# EAGLE design main (EAGLE 7.0.0)
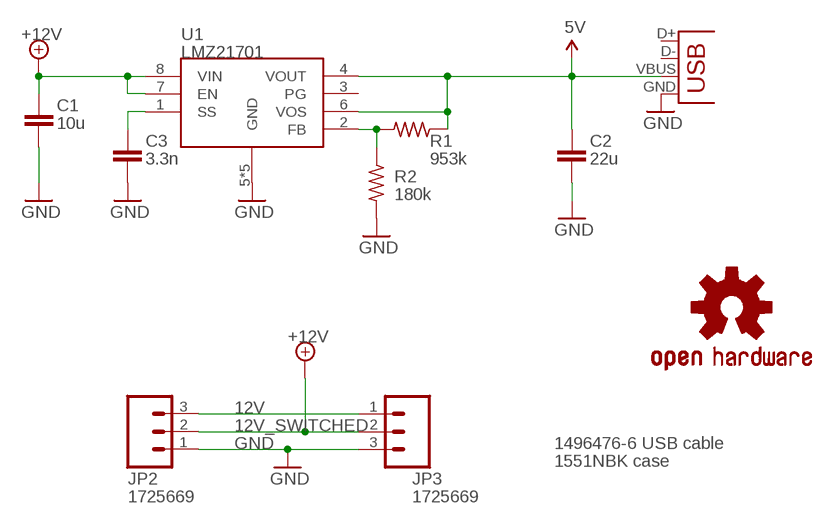
[diagram p0: schematic, sheet 1]

## Parts
C1  10u  C-EUC1206  [C1206]
C2  22u  C-EUC1206  [C1206]
C3  3.3n  C-EUC0603  [C0603]
JP1  62900416021  USB_  [USB-A-S-SILK-FEMALE]
JP2  1725669  M03PTH  [1X03]
JP3  1725669  M03PTH  [1X03]
LOGO1  OSHW-LOGOL  [OSHW-LOGO-L]
R1  953k  R-US_R0603  [R0603]
R2  180k  R-US_R0603  [R0603]
U1  LMZ21701  [LMZ21701]

## Nets
5V: C2.1 JP1.VBUS R1.1 U1.4(VOUT) U1.6(VOS)
12V: JP2.3 JP3.1
12V_SWITCHED: C1.1 JP2.2 JP3.2 U1.7(EN) U1.8(VIN) ; supply symbol labelled +12V
GND: C1.2 C2.2 C3.2 JP1.GND JP2.1 JP3.3 R2.2 U1.5(GND) U1.G1(GND) U1.G1V(GND) U1.G2(GND) U1.G2V(GND)
N$1: C3.1 U1.1(SS)
N$2: R1.2 R2.1 U1.2(FB)
Unconnected: JP1.D+ JP1.D- U1.3(PG)

## Notes on the sheet
- 1496476-6 USB cable
- 1551NBK case

## Library data of the parts
C1-C3 = rcl:C-EU: CAPACITOR, European symbol
JP1 = SparkFun-Connectors:USB: USB Connectors USB-B-PTH is fully proven SKU : PRT-00139/CONN-08278 USB-miniB is fully proven SKU : PRT-00587 USB-A-PCB is untested. USB-A-H is throughly reviewed, but untested. Spark Fun Electronics SKU : PRT-00437 USB-B-SMT is throughly reviewed, but untested. Needs silkscreen touching up. USB-A-S has not been used/tested USB-MB-H has not been used/tested USB-MICROB has been used. CONN-09505
JP2 JP3 = SparkFun-Connectors:M03: Header 3 Standard 3-pin 0.1" header. Use with straight break away headers (SKU : PRT-00116), right angle break away headers (PRT-00553), swiss pins (PRT-00743), machine pins (PRT-00117), and female headers (PRT-00115). Molex polarized connector foot print use with SKU : PRT-08232 with associated crimp pins and housings.
LOGO1 = SparkFun-Aesthetics:OSHW-LOGO: Open Source Hardware Logo This logo indicates the piece of hardware it is found on incorporates a OSHW license and/or adheres to the definition of open source hardware found here: http://freedomdefined.org/OSHW
R1 R2 = rcl:R-US_: RESISTOR, American symbol
U1 = torpedo:LMZ21701

## Board
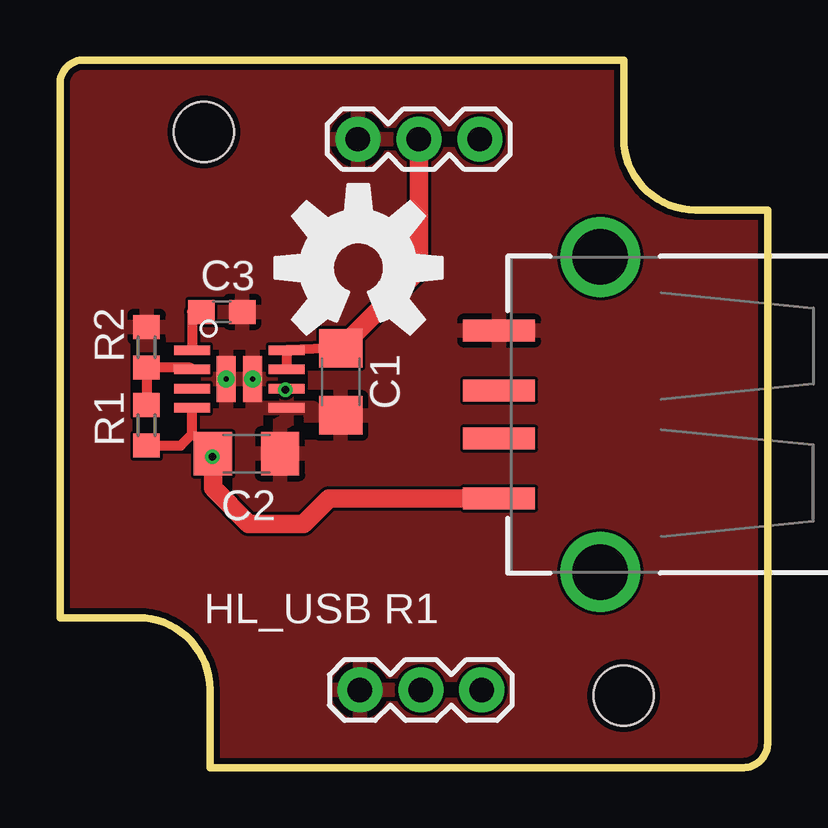
[diagram p1: board, top side]
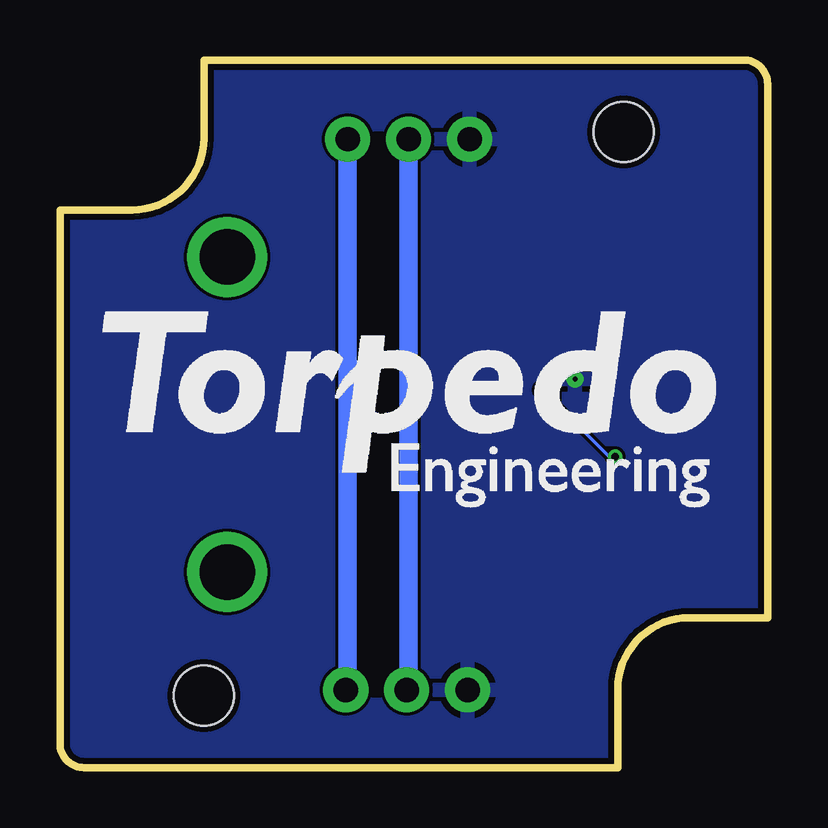
[diagram p2: board, bottom side, seen from below]

Size 29.5 x 29.5 mm. Coordinates in mm from the lower left corner, seen from the top.
Outline: 0,28.5 0,6.25 3.25,6.25 arc-90 6.25,3.25 6.25,0 28.5,0 arc90 29.5,1 29.5,23.25 26.5,23.25 arc-90 23.5,26.25 23.5,29.5 1,29.5 arc90 0,28.5
Copper layers (1*16): Top 0.035mm / dielectric 1.5mm / Bottom 0.035mm
Design rules "dirt_cheap_dirty_boards.v1": minimum track width 5mil, minimum drill 12mil, track to track 5mil, track to pad 5mil, pad to pad 5mil, via to via 5mil, smd to smd 0mil, copper to edge 10mil, drill to drill 10mil, minimum pad ring 10mil, minimum via ring 6mil, stop-mask expansion 2mil, vias tented up to drill 25mil, thermal gap 10mil
Holes 2.5 mm at 6,26.5 23.5,3

### Footprints (pad centres in the part's own frame; a part is rotated, then mirrored left to right if it is on the bottom)
C1206 = smd 1.6 x 1.8: 1 -1.4,0; 2 1.4,0
C0603 = smd 1.1 x 1: 1 -0.85,0; 2 0.85,0
USB-A-S-SILK-FEMALE = smd 3 x 0.9: D+ 7.212,-1; D- 7.212,1; GND 7.212,-3.5; VBUS 7.212,3.5 | drill 2.311: P$5 3,-6.566; P$6 3,6.566
1X03 = drill 1.016 pad 1.88: 1 0,0; 2 2.54,0; 3 5.08,0
R0603 = smd 1 x 1.1: 1 -0.85,0; 2 0.85,0
LMZ21701 = smd 1.5 x 0.4: 1 -0.5,2.4; 2 -0.5,1.6; 3 -0.5,0.8; 4 -0.5,0; 5 3.45,0; 6 3.45,0.8; 7 3.45,1.6; 8 3.45,2.4 | smd 0.8 x 1.9: G1 0.925,1.2; G2 2.025,1.2 | drill 0.2 pad 0.406: G1V 0.925,1.2; G2V 2.025,1.2

### Placement (x,y rotation side)
C1  11.71,16.08 270 top
C2  7.78,13.09 0 top
C3  6.75,19 0 top
JP1  25.52,14.72 180 top
JP2  12.5,3.23 0 top
JP3  17.5,26.2 180 top
LOGO1  12.45,20.83 0 top
R1  3.61,14.27 90 top
R2  3.61,17.52 90 top
U1  6,15 0 top
U$2  [LOGO]  27,14 0 bottom

### Tracks (layer width: path | path; a pad name or v marks a point on that pad's centre or on a via)
5V  (via drill 0.3)
  Top 0.152: C2.1 6.63,13.34 6.73,13.34 | v6.35,12.95 6.73,13.34 | 6.73,13.34 6.99,13.34
  Top 0.254: v9.4,15.75 U1.6
  Top 0.406: C2.1 5.54,13.92 | 5.54,13.92 5.5,13.96 U1.4 | R1.1 5.04,13.42 5.54,13.92
  Top 0.762: JP1.VBUS 11.22,11.22 10.16,10.16 7.87,10.16 6.38,11.66 C2.1
  Bottom 0.152: v9.4,15.75 6.6,12.95 v6.35,12.95
12V
  Bottom 0.762: JP3.1 17.5,3.31 JP2.3
12V_SWITCHED
  Top 0.406: C1.1 U1.8 U1.7
  Top 0.762: JP3.2 14.96,20.74 C1.1
  Bottom 0.762: JP3.2 14.96,3.31 JP2.2
GND
  pour Top: -1.27,30.48 30.48,30.48 30.48,-1.27 -1.27,-1.27
  pour Bottom: -1.27,30.48 30.48,30.48 30.48,-1.27 -1.27,-1.27
N$1
  Top 0.406: C3.1 5.5,19 U1.1
N$2
  Top 0.406: U1.2 5.43,16.67 R2.1 R1.2

### Text on the board
tPlace: HL_USB R1